# Altium schematic sheet Schematic.SchDoc
size A4
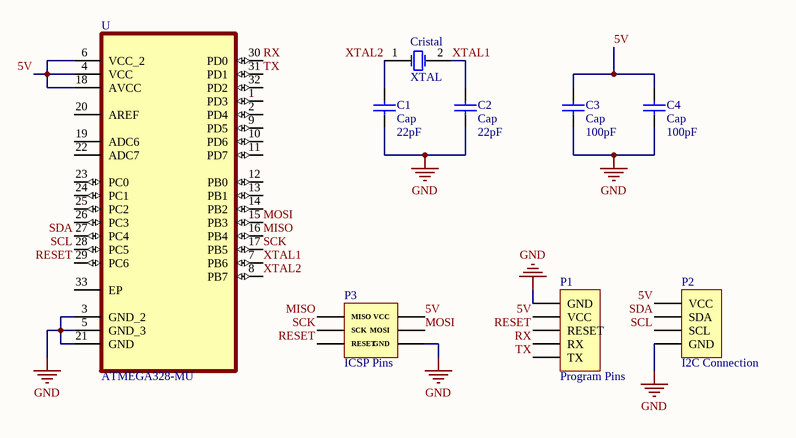
[diagram p0: Schematic.SchDoc]

## Parts
C1  Cap  value 22pF  [RAD-0.3]
C2  Cap  value 22pF  [RAD-0.3]
C3  Cap  value 100pF  [RAD-0.3]
C4  Cap  value 100pF  [RAD-0.3]
Cristal  XTAL  [R38]
P1  Program Pins  [HDR1X5]
P2  I2C Connection  [HDR1X4H]
P3  ICSP Pins  [HDR2X3]
U  ATMEGA328-MU  [QFN50P500X500X100-33N]

## Nets
GND: C1.1 C2.1 C3.1 C4.1 P1.1(GND) P2.4(GND) P3.6(GND) U.3(GND_2) U.5(GND_3) U.21(GND)
5V: C3.2 C4.2 P1.2(VCC) P2.1(VCC) P3.2(VCC) U.4(VCC) U.6(VCC_2) U.18(AVCC)
MISO: P3.1(MISO) U.16(PB4)
MOSI: P3.4(MOSI) U.15(PB3)
RESET: P1.3(RESET) P3.5(RESET) U.29(PC6)
RX: P1.4(RX) U.30(PD0)
SCK: P3.3(SCK) U.17(PB5)
SCL: P2.3(SCL) U.28(PC5)
SDA: P2.2(SDA) U.27(PC4)
TX: P1.5(TX) U.31(PD1)
XTAL1: C2.2 Cristal.2(OSC2) U.7(PB6)
XTAL2: C1.2 Cristal.1(OSC1) U.8(PB7)

Not connected (* = marked no-connect by the designer): U 1(PD3) 2(PD4) 9(PD5) 10(PD6) 11(PD7) 12(PB0) 13(PB1) 14(PB2) 19(ADC6) 20(AREF) 22(ADC7) 23(PC0) 24(PC1) 25(PC2) 26(PC3) 32(PD2) 33(EP)

## Library data of the parts
C1-C4 = Cap: Capacitor; Published: 8-Jun-2000; LatestRevisionDate: 17-Jul-2002; LatestRevisionNote: Re-released for DXP Platform.; PackageReference: RAD-0.3; Publisher: Altium Limited; PackageDescription: Radial Cap, Thru-Hole; 2 Leads; 0.3 in Pin Spacing
Cristal = XTAL: Crystal Oscillator; Published: 8-Jun-2000; LatestRevisionDate: 17-Jul-2002; LatestRevisionNote: Re-released for DXP Platform.; PackageReference: R38; Publisher: Altium Limited; PackageDescription: Crystal, Thru-Hole; 2 Leads; Body 3.1 x 8.2 mm (Dia.xH)
P1 = Header 5: Header, 5-Pin; LatestRevisionDate: 17-Jul-2002; LatestRevisionNote: Re-released for DXP Platform.; Publisher: Altium Limited
P2 = Header 4H: Header, 4-Pin, Right Angle; LatestRevisionDate: 17-Jul-2002; LatestRevisionNote: Re-released for DXP Platform.; Publisher: Altium Limited
P3 = Header 3X2: Header, 3-Pin, Dual row; LatestRevisionDate: 17-Jul-2002; LatestRevisionNote: Re-released for DXP Platform.; Publisher: Altium Limited
U = ATMEGA328-MU: AVR AVRÂ® ATmega Microcontroller IC 8-Bit 20MHz 32KB _16K x 16_ FLASH 32-VQFN _5x5_; MF: Microchip; SnapEDA_Link: https://www.snapeda.com/parts/ATMEGA328-MU/Microchip/view-part/587964/?ref=snap; Value: *; MP: ATMEGA328-MU; Package: VQFN-32 Microchip; Price: None; Availability: Unavailable